# Altium schematic sheet Mcu.SchDoc
size A4; SheetNumber: 3; SheetTotal: 3
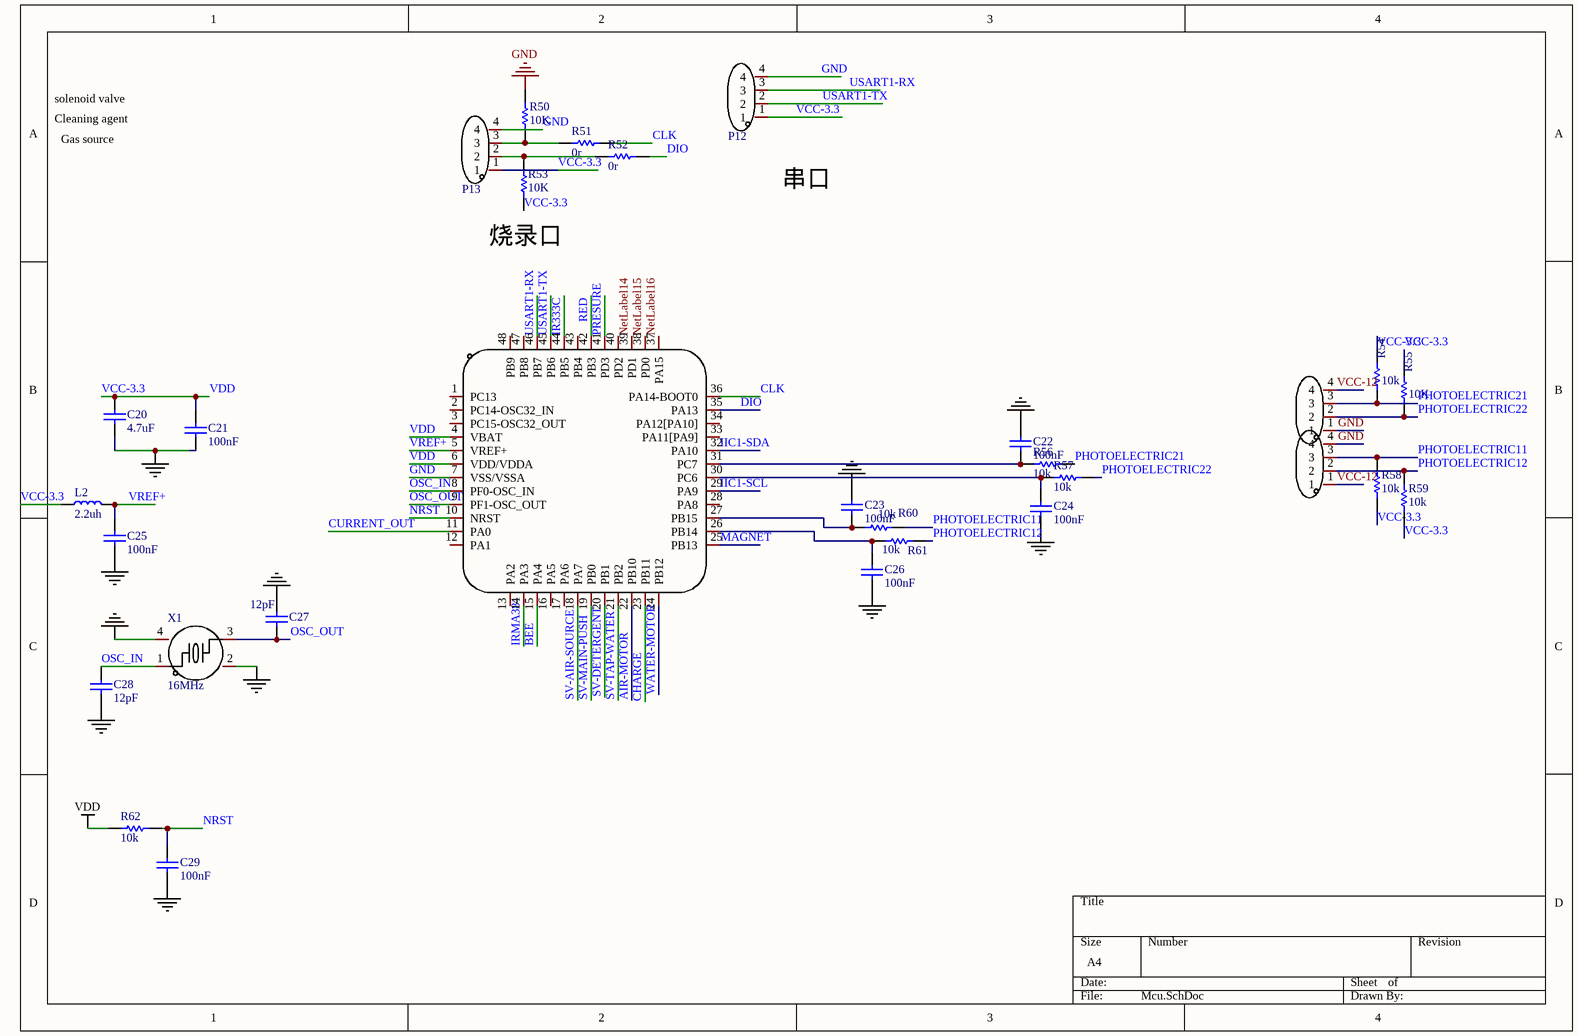
[diagram p0: Mcu.SchDoc]

## Parts
C20  value 4.7uF  [C0402]  (hidden comment: CL05A475MP5NRNC)
C21  value 100nF  [C0402]  (hidden comment: CL05B104KB54PNC)
C22  value 100nF  [C0402]  (hidden comment: CL05B104KB54PNC)
C23  value 100nF  [C0402]  (hidden comment: CL05B104KB54PNC)
C24  value 100nF  [C0402]  (hidden comment: CL05B104KB54PNC)
C25  value 100nF  [C0402]  (hidden comment: CL05B104KB54PNC)
C26  value 100nF  [C0402]  (hidden comment: CL05B104KB54PNC)
C27  value 12pF  [C0402]  (hidden comment: 0402CG120J500NT)
C28  value 12pF  [C0402]  (hidden comment: 0402CG120J500NT)
C29  value 100nF  [C0402]  (hidden comment: CL05B104KB54PNC)
L2  value 2.2uh  [L0603]  (hidden comment: CMI160808U2R2KT)
P12  YTC-HAA200A-4A  [CONN-TH_4P-P2.00_HCTL_HC-PH-4A-X]  (value not drawn)
P13  YTC-HAA200A-4A  [CONN-TH_4P-P2.00_HCTL_HC-PH-4A-X]  (value not drawn)
P14  ZX-HY2.0-4PZZ  [CONN-TH_4P-P2.00_HX20020-4A_2]  (value not drawn)
P15  ZX-HY2.0-4PZZ  [CONN-TH_4P-P2.00_HX20020-4A_2]  (value not drawn)
R50  value 10K  [R0402]  (hidden comment: 0402WGF1002TCE)
R51  value 0r  [R0402]  (hidden comment: 0402WGF0000TCE)
R52  value 0r  [R0402]  (hidden comment: 0402WGF0000TCE)
R53  value 10K  [R0402]  (hidden comment: 0402WGF1002TCE)
R54  value 10k  [R0402]  (hidden comment: 0402WGF1002TCE)
R55  value 10K  [R0402]  (hidden comment: 0402WGF1002TCE)
R56  value 10k  [R0402]  (hidden comment: 0402WGF1002TCE)
R57  value 10k  [R0402]  (hidden comment: 0402WGF1002TCE)
R58  value 10k  [R0402]  (hidden comment: 0402WGF1002TCE)
R59  value 10k  [R0402]  (hidden comment: 0402WGF1002TCE)
R60  value 10k  [R0402]  (hidden comment: 0402WGF1002TCE)
R61  value 10k  [R0402]  (hidden comment: 0402WGF1002TCE)
R62  value 10k  [R0402]  (hidden comment: 0402WGF1002TCE)
U4  STM32G070CBT6  [LQFP-48_L7.0-W7.0-P0.50-LS9.0-BL]  (value not drawn)
X1  Name: 16MHz  [CRYSTAL-SMD_4P-L3.2-W2.5-BL]  (hidden comment: X322516MLB4SI)

## Nets
GND: C20.2 C21.2 C22.1 C23.1 C24.2 C25.2 C26.2 C27.2 C28.1 C29.2 P12.4 P13.4 P14.1 P15.4 R50.2 U4.7(VSS/VSSA) X1.2(GND) X1.4(GND)
VCC-3.3: C20.1 C21.1 L2.1 P12.1 P13.1 R53.1 R54.1 R55.1 R58.1 R59.1 R62.2 U4.4(VBAT) U4.6(VDD/VDDA)  [also labelled VDD]
AIR-MOTOR: U4.22(PB10)
BEE: U4.15(PA4)
CHARGE: U4.23(PB11)
CLK: R51.2 U4.36(PA14-BOOT0)
CURRENT_OUT: U4.11(PA0)
DIO: R52.2 U4.35(PA13)
IIC1-SCL: U4.29(PA9)
IIC1-SDA: U4.32(PA10)
IR333C: U4.44(PB5)
IRMA381: U4.14(PA3)
MAGNET: U4.25(PB13)
NetLabel14: U4.39(PD1)
NetLabel15: U4.38(PD0)
NetLabel16: U4.37(PA15)
NRST: C29.1 R62.1 U4.10(NRST)
OSC_IN: C28.2 U4.8(PF0-OSC_IN) X1.1
OSC_OUT: C27.1 U4.9(PF1-OSC_OUT) X1.3
PHOTOELECTRIC11: P15.3 R58.2 R60.2
PHOTOELECTRIC12: P15.2 R59.2 R61.2
PHOTOELECTRIC21: P14.3 R54.2 R56.2
PHOTOELECTRIC22: P14.2 R55.2 R57.2
PRESURE: U4.41(PD3)
RED: U4.42(PB3)
SV-AIR-SOURCE: U4.18(PA7)
SV-DETERGENT: U4.20(PB1)
SV-MAIN-PUSH: U4.19(PB0)
SV-TAP-WATER: U4.21(PB2)
USART1-RX: P12.3 U4.46(PB7)
USART1-TX: P12.2 U4.45(PB6)
VCC-12: P14.4 P15.1
VREF+: C25.1 L2.2 U4.5(VREF+)
WATER-MOTOR: U4.24(PB12)
NetC22_2: C22.2 R56.1 U4.31(PC7)
NetC23_2: C23.2 R60.1 U4.27(PB15)
NetC24_1: C24.1 R57.1 U4.30(PC6)
NetC26_1: C26.1 R61.1 U4.26(PB14)
NetP13_2: P13.2 R52.1 R53.2
NetP13_3: P13.3 R50.1 R51.1

Not connected (* = marked no-connect by the designer): U4 1(PC13) 2(PC14-OSC32_IN) 3(PC15-OSC32_OUT) 12(PA1) 13(PA2) 16(PA5) 17(PA6) 28(PA8) 33(PA11[PA9]) 34(PA12[PA10]) 40(PD2) 43(PB4) 47(PB8) 48(PB9)

## Notes on the sheet
- solenoid valve
- Cleaning agent
- Gas source
- (near R53) 烧录口
- 串口

## Library data of the parts
C20 = 4.7uf: Published: 8-Jun-2000; LatestRevisionDate: 17-Jul-2002; LatestRevisionNote: Re-released for DXP Platform.; PackageReference: 0402; Publisher: Altium Limited; PackageDescription: Radial Cap, Thru-Hole; 2 Leads; 0.3 in Pin Spacing
C21-C26 C29 = 100nf: Published: 8-Jun-2000; LatestRevisionDate: 17-Jul-2002; LatestRevisionNote: Re-released for DXP Platform.; PackageReference: 0402; Publisher: Altium Limited; PackageDescription: Radial Cap, Thru-Hole; 2 Leads; 0.3 in Pin Spacing
C27 C28 = cap: Capacitor; Published: 8-Jun-2000; LatestRevisionDate: 17-Jul-2002; LatestRevisionNote: Re-released for DXP Platform.; PackageReference: 0402; Publisher: Altium Limited; PackageDescription: Radial Cap, Thru-Hole; 2 Leads; 0.3 in Pin Spacing
L2 = inductance_small: 电感; PackageReference: 0402
P12 P13 = ph 2.0: 4p; Manufacturer: YIYUAN(怡远); Add into BOM: yes; Pins Structure: 1x4P; Pitch: 2mm; Reference Series: PH; Number of PINs Per Row: 4; Symbol: YTC-HAA200A-4A; Device: YTC-HAA200A-4A; LCSC Part Name: PH 2mm 1x4P 直插; Supplier Part: C7436587; Manufacturer Part: YTC-HAA200A-4A; Supplier Footprint: P=2mm; JLCPCB Part Class: 扩展库; Datasheet: https://atta.szlcsc.com/upload/public/pdf/source/20230703/47BD96E2CA2DAFF1FC28F108D442EB09.pdf; Supplier: LCSC; Convert to PCB: yes; Mounting Style: 直插; Number of Pins: 4P; Number of Rows: 1; Name: YTC-HAA200A-4A
P14 P15 = HY2.0-4PZZ: 4p; Manufacturer: Megastar(兆星); Add into BOM: yes; Pins Structure: 1x4P; Pitch: 2mm; Reference Series: HY; Number of PINs Per Row: 4; Current Rating (Max): 2A; Name: ZX-HY2.0-4PZZ; Symbol: ZX-HY2.0-4PZZ; Device: ZX-HY2.0-4PZZ; LCSC Part Name: 1x4P 间距:2mm 直插 系列:HY; Supplier Part: C7429580; Manufacturer Part: ZX-HY2.0-4PZZ; Supplier Footprint: 插件,P=2mm; JLCPCB Part Class: Extended Part; Datasheet: https://atta.szlcsc.com/upload/public/pdf/source/20230619/44026E9B0BFE007E57437F997C730D91.pdf; Supplier: LCSC; Convert to PCB: yes; Mounting Style: 直插; Number of Pins: 4P; Number of Rows: 1; Row Spacing: -; Contact Material: 黄铜; Contact Plating: 锡; Operating Temperature Range: -25℃~+85℃
R50 R53 = 10K: Semiconductor Resistor; Published: 8-Jun-2000; LatestRevisionDate: 17-Jul-2002; LatestRevisionNote: Re-released for DXP Platform.; PackageReference: 0402; Publisher: Altium Limited; PackageDescription: Axial Device, Thru-Hole; 2 Leads; 0.5 in Pin Spacing
R51 R52 = 0r: Published: 8-Jun-2000; LatestRevisionDate: 17-Jul-2002; LatestRevisionNote: Re-released for DXP Platform.; PackageReference: 0402; Publisher: Altium Limited; PackageDescription: Axial Device, Thru-Hole; 2 Leads; 0.5 in Pin Spacing
R54-R62 = Res Semi: Semiconductor Resistor; Published: 8-Jun-2000; LatestRevisionDate: 17-Jul-2002; LatestRevisionNote: Re-released for DXP Platform.; PackageReference: 0402; Publisher: Altium Limited; PackageDescription: Axial Device, Thru-Hole; 2 Leads; 0.5 in Pin Spacing
U4 = STM32G070CBT6: Manufacturer: ST(意法半导体); Add into BOM: yes; Program Storage Size: 128KB; RAM Size: 36KB; CPU Maximum Speed: 64MHz; Program Memory Type: FLASH; Name: STM32G070CBT6; Symbol: STM32G070CBT6; Device: STM32G070CBT6; LCSC Part Name: 主流超值系列Arm Cortex-M0+ MCU，具有128 KB Flash存储器、36 KB RAM、64 MHz CPU、4x USART、定时器、ADC和通信接口，2-3.6V; Supplier Part: C529338; Manufacturer Part: STM32G070CBT6; Supplier Footprint: LQFP-48(7x7); JLCPCB Part Class: Extended Part; Datasheet: https://atta.szlcsc.com/upload/public/pdf/source/20200511/C529338_48C8B1D333BC51E6E9668757AAD26A84.pdf; Supplier: LCSC; Convert to PCB: yes; CPU Core: -; GPIO Ports Number: -; Operating Voltage Range: -; ADC (Bit): -; DAC (Bit): -; PWM (Bit): -; Universal Serial Bus: -; Internal Comparator: -; communication protocol: -; Watchdog: -; Real-Time Clock: -; Infrared Data Association: -; Low-Voltage Detect: -; CCP Capture/Compare: -; Secure Digital Input and Output: -; Direct Memory Access: -; Internal Oscillator: -
X1 = XL7EL89COI-111YLC-16M: Manufacturer: YXC(扬兴晶振); Add into BOM: yes; Crystal Type: 贴片晶振; Value: 16MHz; Normal temperature Frequency Tolerance: ±10ppm; External load capacitor: 12pF; Frequency Stability(Full temperature range): ±20ppm; Symbol: XL7EL89COI-111YLC-16M; Device: XL7EL89COI-111YLC-16M; LCSC Part Name: 16MHz ±10ppm 12pF; Supplier Part: C2965579; Manufacturer Part: XL7EL89COI-111YLC-16M; Supplier Footprint: SMD2016-4P; JLCPCB Part Class: 扩展库; Datasheet: https://atta.szlcsc.com/upload/public/pdf/source/20240329/C26C9A15A73CBCFBF373B30A8E126750.pdf; Supplier: LCSC; Convert to PCB: yes; Equivalent Series Resistance (ESR): -; Operating Temperature: -40℃~+85℃